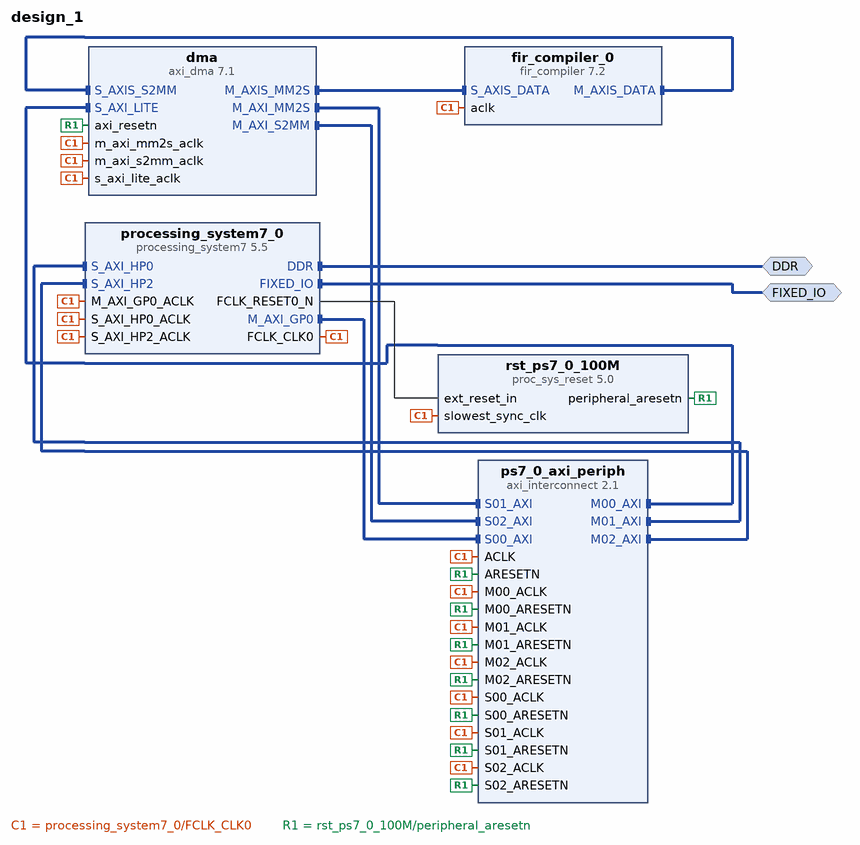
[diagram p0: block diagram of the top level]
# Vivado block design design_1, xc7z020clg400-1, Vivado 2022.2
create_bd_design design_1

create_bd_intf_port -mode Master -vlnv xilinx.com:interface:ddrx_rtl:1.0 DDR
create_bd_intf_port -mode Master -vlnv xilinx.com:display_processing_system7:fixedio_rtl:1.0 FIXED_IO

create_bd_cell -type ip -vlnv xilinx.com:ip:axi_dma:7.1 dma
set_property -dict [list \
  CONFIG.c_include_s2mm 1 \
  CONFIG.c_include_sg 0 \
  CONFIG.c_m_axi_mm2s_data_width 64 \
  CONFIG.c_m_axi_s2mm_data_width 64 \
  CONFIG.c_micro_dma 0 \
  CONFIG.c_mm2s_burst_size 16 \
  CONFIG.c_s_axis_s2mm_tdata_width 32 \
  CONFIG.c_sg_length_width 26 \
  CONFIG.c_single_interface 0 \
] [get_bd_cells dma]
create_bd_cell -type ip -vlnv xilinx.com:ip:fir_compiler:7.2 fir_compiler_0
set_property -dict [list \
  CONFIG.BestPrecision true \
  CONFIG.CoefficientVector 0.00150,-0.00000,-0.00235,0.00000,0.00489,-0.00000,-0.00968,0.00000,0.01757,-0.00000,-0.03024,0.00000,0.05195,-0.00000,-0.09865,0.00000,0.31537,0.49929,0.31537,0.00000,-0.09865,-0.00000,0.05195,0.00000,-0.03024,-0.00000,0.01757,0.00000,-0.00968,-0.00000,0.00489,0.00000,-0.00235,-0.00000,0.00150 \
  CONFIG.Coefficient_Fractional_Bits 32 \
  CONFIG.Coefficient_Sets 1 \
  CONFIG.Coefficient_Sign Signed \
  CONFIG.Coefficient_Structure Inferred \
  CONFIG.Coefficient_Width 32 \
  CONFIG.DATA_Has_TLAST Packet_Framing \
  CONFIG.Data_Width 32 \
  CONFIG.M_DATA_Has_TREADY true \
  CONFIG.Output_Rounding_Mode Non_Symmetric_Rounding_Down \
  CONFIG.Output_Width 32 \
  CONFIG.Quantization Quantize_Only \
  CONFIG.Stopband_Max 0.6 \
] [get_bd_cells fir_compiler_0]
create_bd_cell -type ip -vlnv xilinx.com:ip:processing_system7:5.5 processing_system7_0
set_property -dict [list \
  CONFIG.PCW_APU_PERIPHERAL_FREQMHZ 650 \
  CONFIG.PCW_CRYSTAL_PERIPHERAL_FREQMHZ 50 \
  CONFIG.PCW_ENET0_ENET0_IO {MIO 16 .. 27} \
  CONFIG.PCW_ENET0_GRP_MDIO_ENABLE 1 \
  CONFIG.PCW_ENET0_GRP_MDIO_IO {MIO 52 .. 53} \
  CONFIG.PCW_ENET0_PERIPHERAL_ENABLE 1 \
  CONFIG.PCW_ENET0_RESET_ENABLE 1 \
  CONFIG.PCW_ENET0_RESET_IO {MIO 9} \
  CONFIG.PCW_ENET_RESET_ENABLE 1 \
  CONFIG.PCW_ENET_RESET_SELECT {Share reset pin} \
  CONFIG.PCW_FPGA0_PERIPHERAL_FREQMHZ 100 \
  CONFIG.PCW_FPGA1_PERIPHERAL_FREQMHZ 50 \
  CONFIG.PCW_GPIO_MIO_GPIO_ENABLE 1 \
  CONFIG.PCW_GPIO_MIO_GPIO_IO MIO \
  CONFIG.PCW_I2C_RESET_ENABLE 1 \
  CONFIG.PCW_PERIPHERAL_BOARD_PRESET None \
  CONFIG.PCW_PRESET_BANK1_VOLTAGE {LVCMOS 1.8V} \
  CONFIG.PCW_QSPI_GRP_FBCLK_ENABLE 1 \
  CONFIG.PCW_QSPI_GRP_FBCLK_IO {MIO 8} \
  CONFIG.PCW_QSPI_GRP_SINGLE_SS_ENABLE 1 \
  CONFIG.PCW_QSPI_GRP_SINGLE_SS_IO {MIO 1 .. 6} \
  CONFIG.PCW_QSPI_PERIPHERAL_ENABLE 1 \
  CONFIG.PCW_QSPI_QSPI_IO {MIO 1 .. 6} \
  CONFIG.PCW_SD0_GRP_CD_ENABLE 1 \
  CONFIG.PCW_SD0_GRP_CD_IO {MIO 47} \
  CONFIG.PCW_SD0_GRP_WP_ENABLE 0 \
  CONFIG.PCW_SD0_PERIPHERAL_ENABLE 1 \
  CONFIG.PCW_SD0_SD0_IO {MIO 40 .. 45} \
  CONFIG.PCW_SDIO_PERIPHERAL_FREQMHZ 50 \
  CONFIG.PCW_SINGLE_QSPI_DATA_MODE x4 \
  CONFIG.PCW_UART0_PERIPHERAL_ENABLE 1 \
  CONFIG.PCW_UART0_UART0_IO {MIO 14 .. 15} \
  CONFIG.PCW_UART1_PERIPHERAL_ENABLE 0 \
  CONFIG.PCW_UART_PERIPHERAL_FREQMHZ 100 \
  CONFIG.PCW_UIPARAM_DDR_BUS_WIDTH {16 Bit} \
  CONFIG.PCW_UIPARAM_DDR_FREQ_MHZ 525 \
  CONFIG.PCW_UIPARAM_DDR_PARTNO {MT41J256M16 RE-125} \
  CONFIG.PCW_USB0_PERIPHERAL_ENABLE 1 \
  CONFIG.PCW_USB0_RESET_ENABLE 1 \
  CONFIG.PCW_USB0_RESET_IO {MIO 46} \
  CONFIG.PCW_USB0_USB0_IO {MIO 28 .. 39} \
  CONFIG.PCW_USB_RESET_ENABLE 1 \
  CONFIG.PCW_USB_RESET_SELECT {Share reset pin} \
  CONFIG.PCW_USE_S_AXI_HP0 1 \
  CONFIG.PCW_USE_S_AXI_HP2 1 \
] [get_bd_cells processing_system7_0]
# 483 more settings of processing_system7_0 are not shown: defaults, MIO pin electricals, DDR timing, and values the tool derives
create_bd_cell -type ip -vlnv xilinx.com:ip:axi_interconnect:2.1 ps7_0_axi_periph
set_property -dict {CONFIG.NUM_MI 3 CONFIG.NUM_SI 3} [get_bd_cells ps7_0_axi_periph]
create_bd_cell -type ip -vlnv xilinx.com:ip:proc_sys_reset:5.0 rst_ps7_0_100M

# ---- connections ----

connect_bd_intf_net [get_bd_intf_pins dma/M_AXI_MM2S] [get_bd_intf_pins ps7_0_axi_periph/S01_AXI]
connect_bd_intf_net [get_bd_intf_pins dma/M_AXIS_MM2S] [get_bd_intf_pins fir_compiler_0/S_AXIS_DATA]
connect_bd_intf_net [get_bd_intf_pins dma/M_AXI_S2MM] [get_bd_intf_pins ps7_0_axi_periph/S02_AXI]
connect_bd_intf_net [get_bd_intf_pins dma/S_AXIS_S2MM] [get_bd_intf_pins fir_compiler_0/M_AXIS_DATA]
connect_bd_intf_net [get_bd_intf_ports DDR] [get_bd_intf_pins processing_system7_0/DDR]
connect_bd_intf_net [get_bd_intf_ports FIXED_IO] [get_bd_intf_pins processing_system7_0/FIXED_IO]
connect_bd_intf_net [get_bd_intf_pins processing_system7_0/M_AXI_GP0] [get_bd_intf_pins ps7_0_axi_periph/S00_AXI]
connect_bd_intf_net [get_bd_intf_pins dma/S_AXI_LITE] [get_bd_intf_pins ps7_0_axi_periph/M00_AXI]
connect_bd_intf_net [get_bd_intf_pins processing_system7_0/S_AXI_HP0] [get_bd_intf_pins ps7_0_axi_periph/M01_AXI]
connect_bd_intf_net [get_bd_intf_pins processing_system7_0/S_AXI_HP2] [get_bd_intf_pins ps7_0_axi_periph/M02_AXI]
connect_bd_net [get_bd_pins processing_system7_0/FCLK_CLK0] \
  [get_bd_pins dma/m_axi_mm2s_aclk] [get_bd_pins dma/m_axi_s2mm_aclk] [get_bd_pins dma/s_axi_lite_aclk] \
  [get_bd_pins fir_compiler_0/aclk] [get_bd_pins processing_system7_0/M_AXI_GP0_ACLK] \
  [get_bd_pins processing_system7_0/S_AXI_HP0_ACLK] [get_bd_pins processing_system7_0/S_AXI_HP2_ACLK] \
  [get_bd_pins ps7_0_axi_periph/ACLK] [get_bd_pins ps7_0_axi_periph/M00_ACLK] [get_bd_pins ps7_0_axi_periph/M01_ACLK] \
  [get_bd_pins ps7_0_axi_periph/M02_ACLK] [get_bd_pins ps7_0_axi_periph/S00_ACLK] [get_bd_pins ps7_0_axi_periph/S01_ACLK] \
  [get_bd_pins ps7_0_axi_periph/S02_ACLK] [get_bd_pins rst_ps7_0_100M/slowest_sync_clk]
connect_bd_net [get_bd_pins processing_system7_0/FCLK_RESET0_N] [get_bd_pins rst_ps7_0_100M/ext_reset_in]
connect_bd_net [get_bd_pins rst_ps7_0_100M/peripheral_aresetn] \
  [get_bd_pins dma/axi_resetn] [get_bd_pins ps7_0_axi_periph/ARESETN] [get_bd_pins ps7_0_axi_periph/M00_ARESETN] \
  [get_bd_pins ps7_0_axi_periph/M01_ARESETN] [get_bd_pins ps7_0_axi_periph/M02_ARESETN] \
  [get_bd_pins ps7_0_axi_periph/S00_ARESETN] [get_bd_pins ps7_0_axi_periph/S01_ARESETN] \
  [get_bd_pins ps7_0_axi_periph/S02_ARESETN]

# ---- address map ----
assign_bd_address -offset 0x00000000 -range 256M -target_address_space [get_bd_addr_spaces dma/Data_MM2S] [get_bd_addr_segs processing_system7_0/S_AXI_HP0/HP0_DDR_LOWOCM]
assign_bd_address -offset 0x10000000 -range 256M -target_address_space [get_bd_addr_spaces dma/Data_MM2S] [get_bd_addr_segs processing_system7_0/S_AXI_HP2/HP2_DDR_LOWOCM]
exclude_bd_addr_seg -offset 0x40400000 -range 64K -target_address_space [get_bd_addr_spaces dma/Data_MM2S] [get_bd_addr_segs dma/S_AXI_LITE/Reg]
assign_bd_address -offset 0x00000000 -range 256M -target_address_space [get_bd_addr_spaces dma/Data_S2MM] [get_bd_addr_segs processing_system7_0/S_AXI_HP0/HP0_DDR_LOWOCM]
assign_bd_address -offset 0x10000000 -range 256M -target_address_space [get_bd_addr_spaces dma/Data_S2MM] [get_bd_addr_segs processing_system7_0/S_AXI_HP2/HP2_DDR_LOWOCM]
exclude_bd_addr_seg -offset 0x40400000 -range 64K -target_address_space [get_bd_addr_spaces dma/Data_S2MM] [get_bd_addr_segs dma/S_AXI_LITE/Reg]
assign_bd_address -offset 0x40400000 -range 64K -target_address_space [get_bd_addr_spaces processing_system7_0/Data] [get_bd_addr_segs dma/S_AXI_LITE/Reg]
exclude_bd_addr_seg -offset 0x00000000 -range 512M -target_address_space [get_bd_addr_spaces processing_system7_0/Data] [get_bd_addr_segs processing_system7_0/S_AXI_HP0/HP0_DDR_LOWOCM]
exclude_bd_addr_seg -offset 0x00000000 -range 512M -target_address_space [get_bd_addr_spaces processing_system7_0/Data] [get_bd_addr_segs processing_system7_0/S_AXI_HP2/HP2_DDR_LOWOCM]

validate_bd_design
save_bd_design
